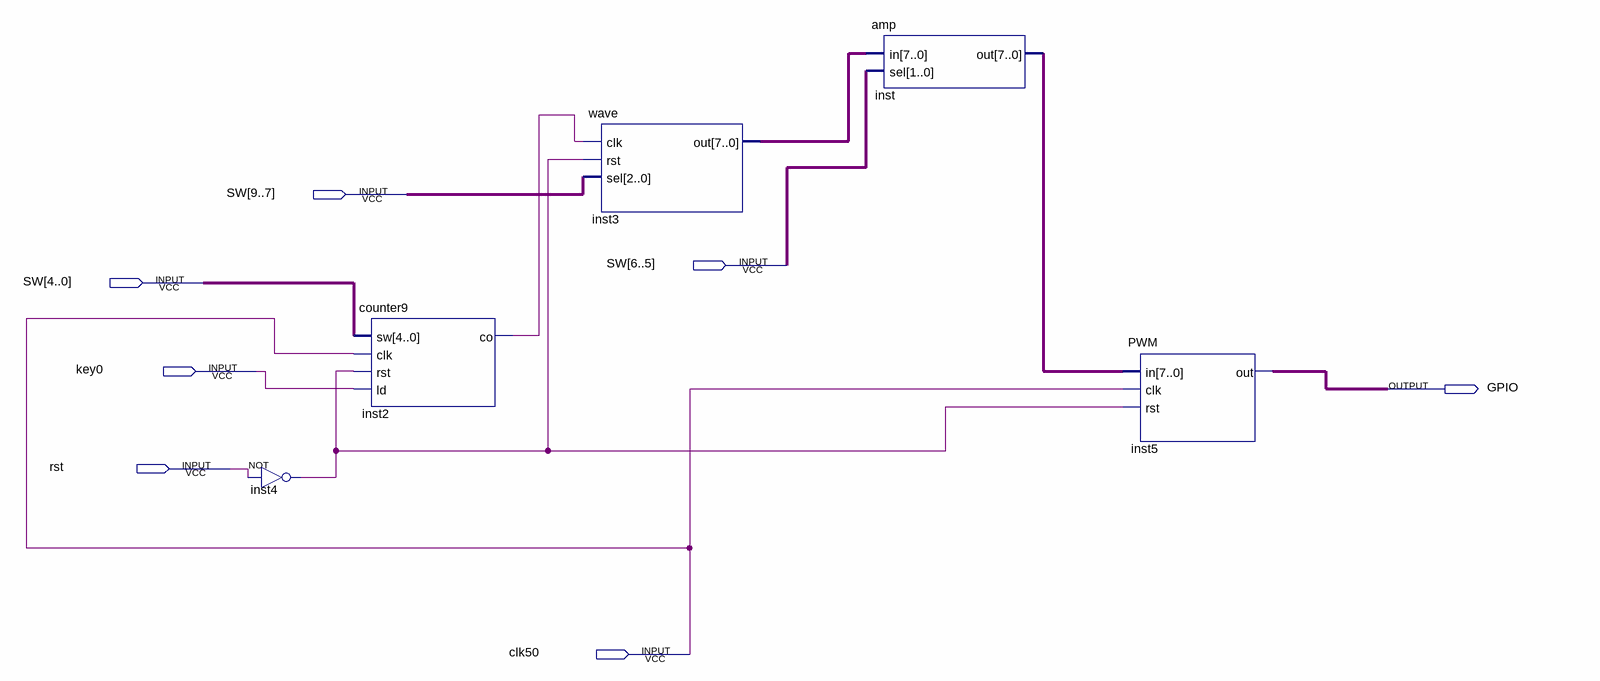
[diagram p0: schematic sheet]
// Quartus schematic l3.bdf as structural Verilog: 5 symbols, 7 pins
module l3 (
  input  [9:0] SW,
  input  key0,
  input  rst,
  input  clk50,
  output GPIO
);

  wire inst2_co, inst4_out;
  wire [7:0] inst3_out, inst_out;

  not inst4 (inst4_out, rst);
  counter9 inst2 (.sw(SW[4:0]), .clk(clk50), .rst(inst4_out), .ld(key0), .co(inst2_co));
  wave inst3 (.clk(inst2_co), .rst(inst4_out), .sel(SW[9:7]), .out(inst3_out));
  amp inst (.in(inst3_out), .sel(SW[6:5]), .out(inst_out));
  PWM inst5 (.in(inst_out), .clk(clk50), .rst(inst4_out), .out(GPIO));
endmodule
